# EAGLE design v3_LED_cpu (EAGLE 4.16)
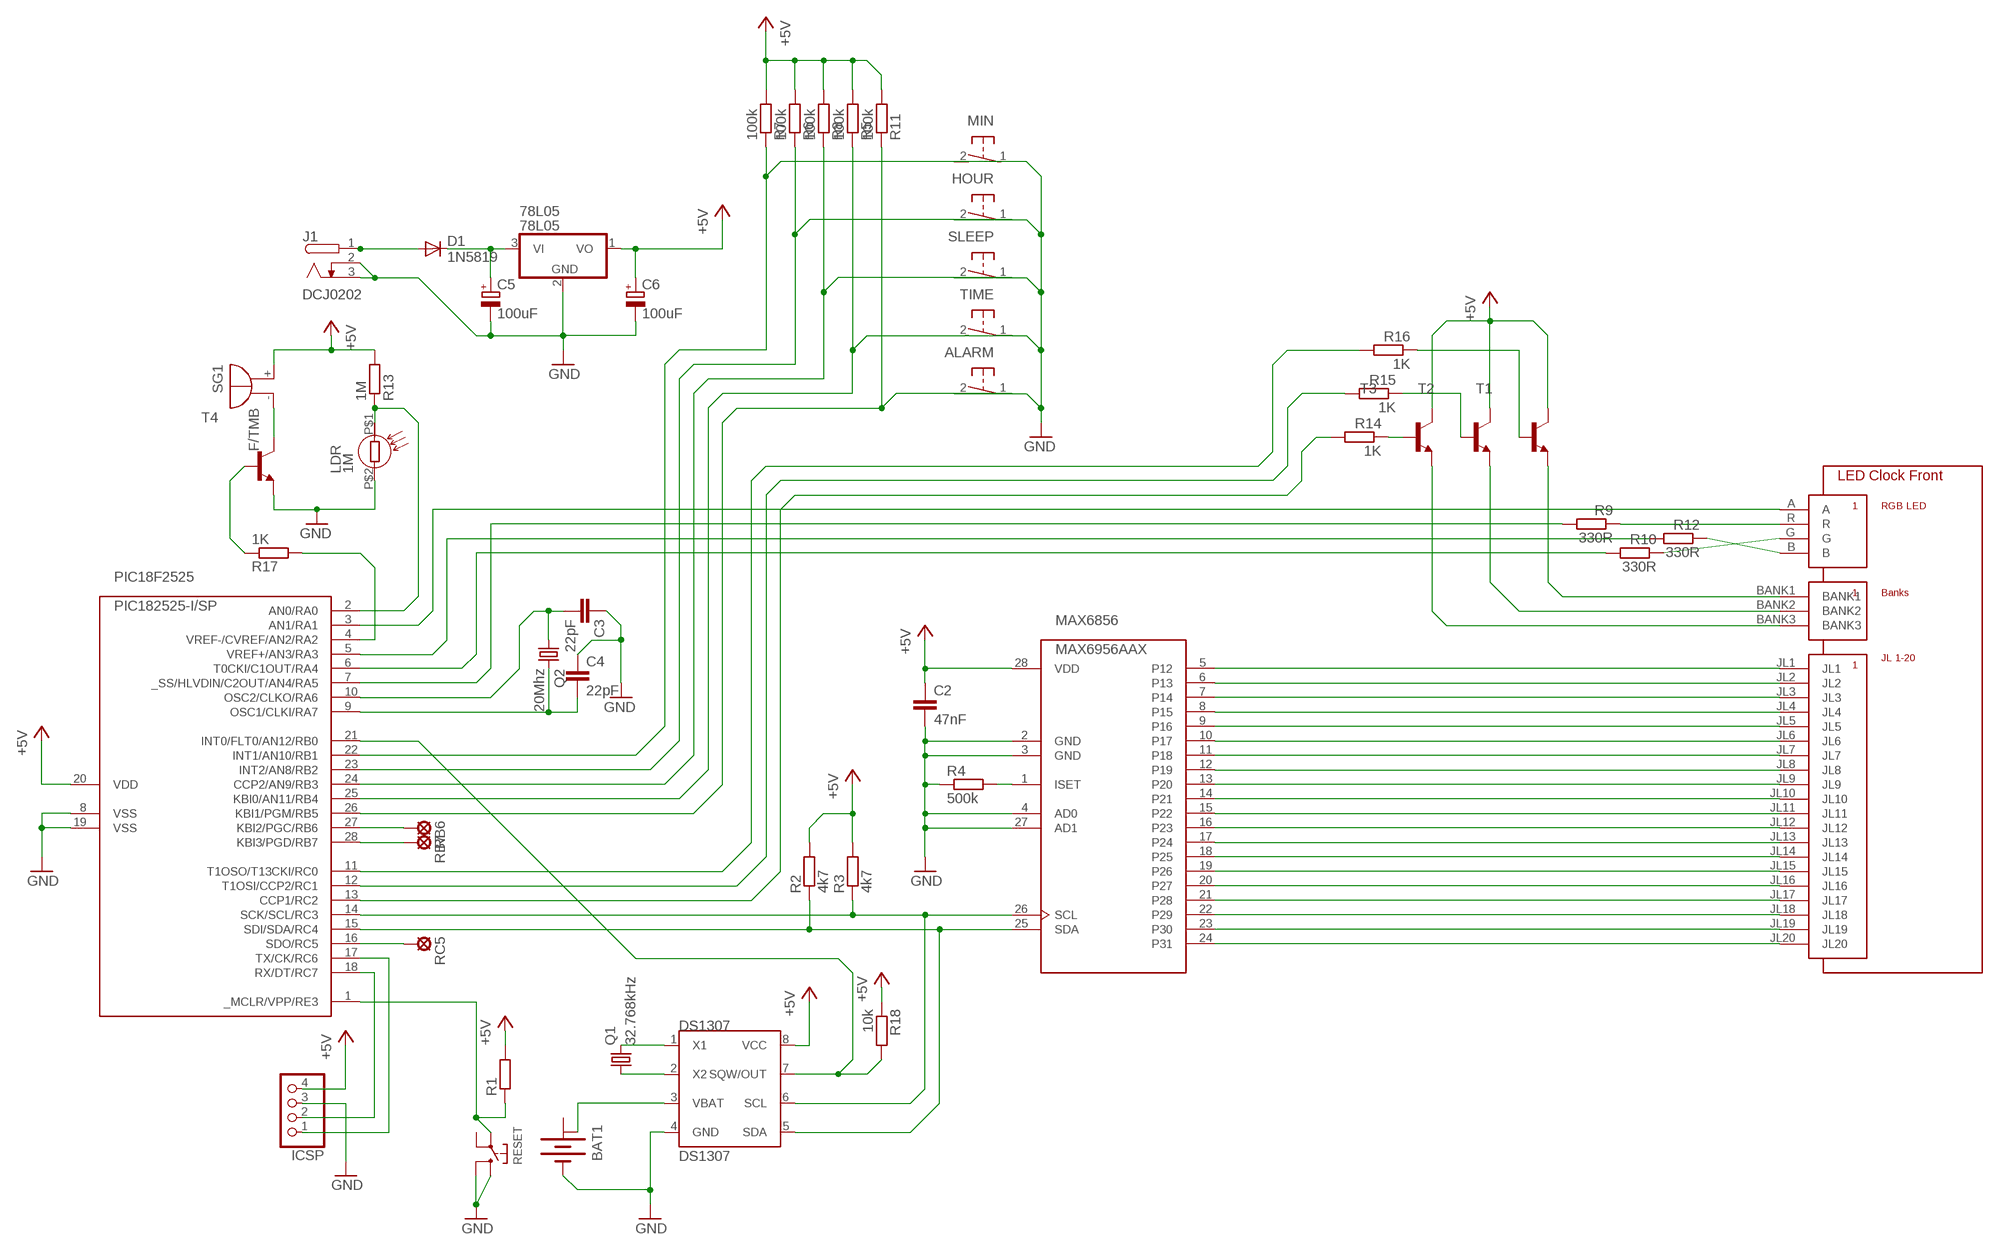
[diagram p0: schematic, sheet 1]

## Parts
78L05  78L05  [TO92-INLINE]
ALARM  ITT-PTS645_SIDEWAYS  [ITT-MINI_SIDEWAYS]
BAT1  BATTERY  [BATTERY]
C2  47nF  C-EUC0603  [C0603]
C3  22pF  C-EUC0603  [C0603]
C4  22pF  C-EUC0603  [C0603]
C5  100uF  CPOL-EUE2.5-7  [E2,5-7]
C6  100uF  CPOL-EUE2.5-7  [E2,5-7]
D1  1N5819  DIODE-F126-10  [F126-10]
DS1307  DS1307  [DIL08]
HOUR  ITT-PTS645_SIDEWAYS  [ITT-MINI_SIDEWAYS]
ICSP  PINHD-1X4  [1X04]
J1  DCJ0202  [DCJ0202]
LDR  1M  LDRSIDE  [LDR_4MM_SIDE]
MAX6856  MAX6956AAX  [DIL28-3]
MIN  ITT-PTS645_SIDEWAYS  [ITT-MINI_SIDEWAYS]
PIC18F2525  PIC182525-I/SP  [DIL28-3]
Q1  32.768kHz  CRYTALTC26H  [TC26H]
Q2  20Mhz  CRYTALHC49U-V  [HC49U-V]
R1  R-EU_R0603  [R0603]
R2  4k7  R-EU_R0603  [R0603]
R3  4k7  R-EU_R0603  [R0603]
R4  500k  R-EU_R0603  [R0603]
R5  100k  R-EU_R0603  [R0603]
R6  100k  R-EU_R0603  [R0603]
R7  100k  R-EU_R0603  [R0603]
R8  100k  R-EU_R0603  [R0603]
R9  330R  R-EU_R0603  [R0603]
R10  330R  R-EU_R0603  [R0603]
R11  100k  R-EU_R0603  [R0603]
R12  330R  R-EU_R0603  [R0603]
R13  1M  R-EU_R0603  [R0603]
R14  1K  R-EU_R0603  [R0603]
R15  1K  R-EU_R0603  [R0603]
R16  1K  R-EU_R0603  [R0603]
R17  1K  R-EU_R0603  [R0603]
R18  10k  R-EU_R0603  [R0603]
RB6  LSP10  [LSP10]
RB7  LSP10  [LSP10]
RC5  LSP10  [LSP10]
RESET  ITT-PTS645  [ITT-MINI]
SG1  F/TMB  [F/TMB]
SLEEP  ITT-PTS645_SIDEWAYS  [ITT-MINI_SIDEWAYS]
T1  BC547B-NPN-TO92-EBC  [TO92-EBC]
T2  BC547B-NPN-TO92-EBC  [TO92-EBC]
T3  BC547B-NPN-TO92-EBC  [TO92-EBC]
T4  BC547B-NPN-TO92-EBC  [TO92-EBC]
TIME  ITT-PTS645_SIDEWAYS  [ITT-MINI_SIDEWAYS]
U$1  LEDCLOCK_FRONT  [LEDCLOCK_FRONT]

## Nets
+5V: 78L05.1(VO) C2.1 C6.+ DS1307.8(VCC) ICSP.4 MAX6856.28(VDD) PIC18F2525.20(VDD) R1.2 R2.2 R3.2 R5.2 R6.2 R7.2 R8.2 R11.2 R13.2 R18.1 SG1.+ T1.C T2.C T3.C
GND: 78L05.2(GND) ALARM.2(S) BAT1.- C2.2 C3.1 C4.1 C5.- C6.- DS1307.4(GND) HOUR.2(S) ICSP.3 J1.2 J1.3 LDR.P$2 MAX6856.2(GND) MAX6856.3(GND) MAX6856.4(AD0) MAX6856.27(AD1) MIN.2(S) PIC18F2525.8(VSS) PIC18F2525.19(VSS) R4.1 RESET.P$1(S1) RESET.P$2(S) SLEEP.2(S) T4.E TIME.2(S)
LED6: MAX6856.10(P17) U$1.JL6
N$1: DS1307.6(SCL) MAX6856.26(SCL) PIC18F2525.14(SCK/SCL/RC3) R3.1
N$2: DS1307.5(SDA) MAX6856.25(SDA) PIC18F2525.15(SDI/SDA/RC4) R2.1
N$3: MAX6856.15(P22) U$1.JL11
N$5: PIC18F2525.27(KBI2/PGC/RB6) RB6.MP
N$6: PIC18F2525.28(KBI3/PGD/RB7) RB7.MP
N$7: MAX6856.1(ISET) R4.2
N$8: PIC18F2525.1(_MCLR/VPP/RE3) R1.1 RESET.P$4(P)
N$9: PIC18F2525.16(SDO/RC5) RC5.MP
N$10: MAX6856.5(P12) U$1.JL1
N$11: MAX6856.6(P13) U$1.JL2
N$12: MAX6856.7(P14) U$1.JL3
N$13: MAX6856.8(P15) U$1.JL4
N$14: MAX6856.9(P16) U$1.JL5
N$15: MAX6856.16(P23) U$1.JL12
N$16: MAX6856.11(P18) U$1.JL7
N$17: MAX6856.17(P24) U$1.JL13
N$18: MAX6856.13(P20) U$1.JL9
N$19: MAX6856.14(P21) U$1.JL10
N$20: BAT1.+@1(+) DS1307.3(VBAT)
N$21: PIC18F2525.11(T1OSO/T13CKI/RC0) R16.2
N$22: MAX6856.12(P19) U$1.JL8
N$23: PIC18F2525.13(CCP1/RC2) R14.2
N$24: PIC18F2525.12(T1OSI/CCP2/RC1) R15.2
N$25: DS1307.1(X1) Q1.2
N$26: DS1307.2(X2) Q1.1
N$27: DS1307.7(SQW/OUT) PIC18F2525.21(INT0/FLT0/AN12/RB0) R18.2
N$28: PIC18F2525.5(VREF+/AN3/RA3) R12.2
N$29: R9.1 U$1.R
N$30: MAX6856.18(P25) U$1.JL14
N$31: R14.1 T3.B
N$32: ALARM.1(P) PIC18F2525.26(KBI1/PGM/RB5) R11.1
N$33: C4.2 PIC18F2525.9(OSC1/CLKI/RA7) Q2.2
N$34: C3.2 PIC18F2525.10(OSC2/CLKO/RA6) Q2.1
N$35: PIC18F2525.7(_SS/HLVDIN/C2OUT/AN4/RA5) R9.2
N$36: PIC18F2525.6(T0CKI/C1OUT/RA4) R10.2
N$37: MAX6856.19(P26) U$1.JL15
N$38: MAX6856.20(P27) U$1.JL16
N$39: MAX6856.21(P28) U$1.JL17
N$40: MAX6856.22(P29) U$1.JL18
N$41: MAX6856.23(P30) U$1.JL19
N$42: MAX6856.24(P31) U$1.JL20
N$43: T3.E U$1.BANK3
N$44: T2.E U$1.BANK2
N$45: T1.E U$1.BANK1
N$46: R10.1 U$1.G
N$47: R12.1 U$1.B
N$48: ICSP.2 PIC18F2525.18(RX/DT/RC7)
N$49: ICSP.1 PIC18F2525.17(TX/CK/RC6)
N$50: LDR.P$1 PIC18F2525.2(AN0/RA0) R13.1
N$51: R15.1 T2.B
N$52: 78L05.3(VI) C5.+ D1.C
N$53: D1.A J1.1
N$54: R16.1 T1.B
N$55: SG1.- T4.C
N$57: PIC18F2525.25(KBI0/AN11/RB4) R5.1 TIME.1(P)
N$58: R17.1 T4.B
N$59: PIC18F2525.4(VREF-/CVREF/AN2/RA2) R17.2
N$60: PIC18F2525.3(AN1/RA1) U$1.A
N$61: PIC18F2525.24(CCP2/AN9/RB3) R8.1 SLEEP.1(P)
N$62: HOUR.1(P) PIC18F2525.23(INT2/AN8/RB2) R6.1
N$63: MIN.1(P) PIC18F2525.22(INT1/AN10/RB1) R7.1
Unconnected: RESET.P$3(P1)

## Power pins joined to a net without a drawn wire
+: BAT1.+

## Library data of the parts
78L05 = linear:78*: Positive VOLTAGE REGULATOR Source: http://cache.national.com/ds/LM/LM78L05.pdf http://www.fairchildsemi.com/ds/LM/LM7805.pdf
ALARM HOUR MIN SLEEP TIME = catmacey:ITT-PTS645_SIDEWAYS: OMRON SWITCH
BAT1 = special:BATTERY: BATTERY
C2-C4 = rcl:C-EU: CAPACITOR, European symbol
C5 C6 = rcl:CPOL-EU: POLARIZED CAPACITOR, European symbol
D1 = diode:DIODE-: DIODE
DS1307 = dallas:DS1307*: I2C Serial RTC w/56 bytes battery backed RAM
ICSP = pinhead:PINHD-1X4: PIN HEADER
J1 = con-jack:DCJ0202: DC POWER JACK Source: DCJ0202.pdf
LDR = catmacey:LDR
MAX6856 = catmacey:MAX6956: The MAX6956 compact, serial-interfaced LED display driver/I/O expander provide microprocessors with up to 28 ports. Each port is individually user configurable to either a logic input, logic output, or common-anode (CA) LED constant-current segment driver. Each port configured as an LED segment driver behaves as a digitally controlled constant-current sink, with 16 equal current steps from 1.5mA to 24mA. The LED drivers are suitable for both discrete LEDs and CA numeric and alphanumeric LED digits. Each port configured as a general-purpose I/O (GPIO) can be either a push-pull logic output capable of sinking 10mA and sourcing 4.5mA, or a Schmitt logic input with optional internal pullup. Seven ports feature configurable transition detection logic, which generates an interrupt upon change of port logic level. The MAX6956 is controlled through an I2C-compatible 2-wire serial interface, and uses four-level logic to allow 16 I2C addresses from only 2 select pins. 400kbps I2C-Compatible Serial Interface 2.5V to 5.5V Operation -40°C to +125°C Temperature Range 20 or 28 I/O Ports, Each Configurable as Constant-Current LED Driver Push-Pull Logic Output Schmitt Logic Input Schmitt Logic Input with Internal Pullup 11μA (max) Shutdown Current 16-Step Individually Programmable Current Control for Each LED Logic Transition Detection for Seven I/O Ports
PIC18F2525 = catmacey:PIC18*2525: PIC18*2525 Microchip FLASH Microcontroller DEVICE FEATURES Feature PIC18*2525 Program Memory (bytes) 48k Program Memory (instructions) 24576 I/O Ports Ports A, B, C, (E) Capture/Compare/PWM Modules 2 Enhanced Capture/Compare/PWM Modules 0 Parallel Communications (PSP) No 10-bit Analog-to-Digital Module 10 input Channels Package Types 28-pin PDIP 28-pin SOIC NOTES: F only after 18, means standard voltage range from 4.2v to 5.5v LF after 18, means extended voltage range from 2.0v to 5.5v T after entire device number, means supplied in tape and reel TQFP packages only -E before / denotes extended temperature range from -40°C to +120°C -I before / denotes industrial temperature range from -40°C to +85°C /PT suffix denotes TQFP package /SO suffix denotes SOIC package /SP suffix denotes Skinny Plastic DIP package /P suffix denotes Plastic DIP package /ML suffix denotes QFN package
Q1 Q2 = crystal:CRYTAL: CRYSTAL
R1-R18 = rcl:R-EU_: RESISTOR, European symbol
RB6 RB7 RC5 = solpad:LSP10: SOLDER PAD drill 1.0 mm, distributor Buerklin, 12H555
RESET = catmacey:ITT-PTS645: ITT SWITCH
SG1 = buzzer:F/TMB: BUZZER Source: Buerklin
T1-T4 = transistor:*-NPN-: NPN Transistror
U$1 = catmacey:LEDCLOCK_FRONT

## Board
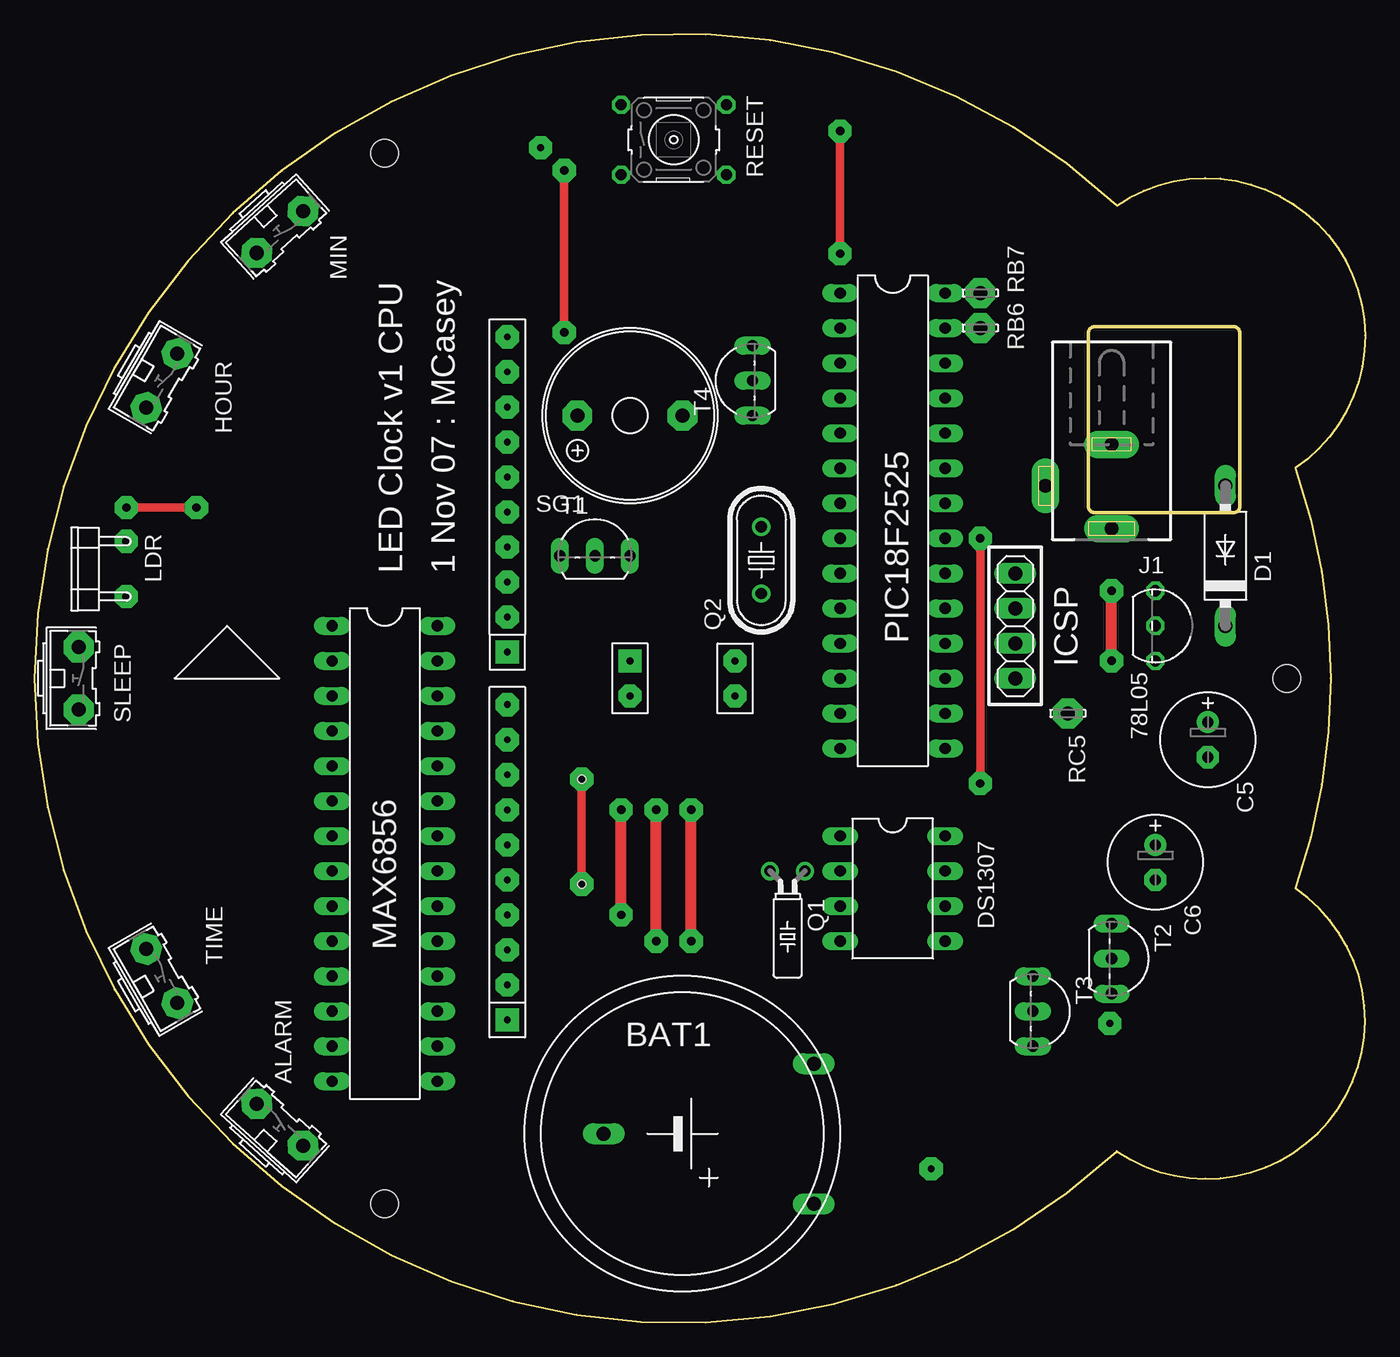
[diagram p1: board, top side]
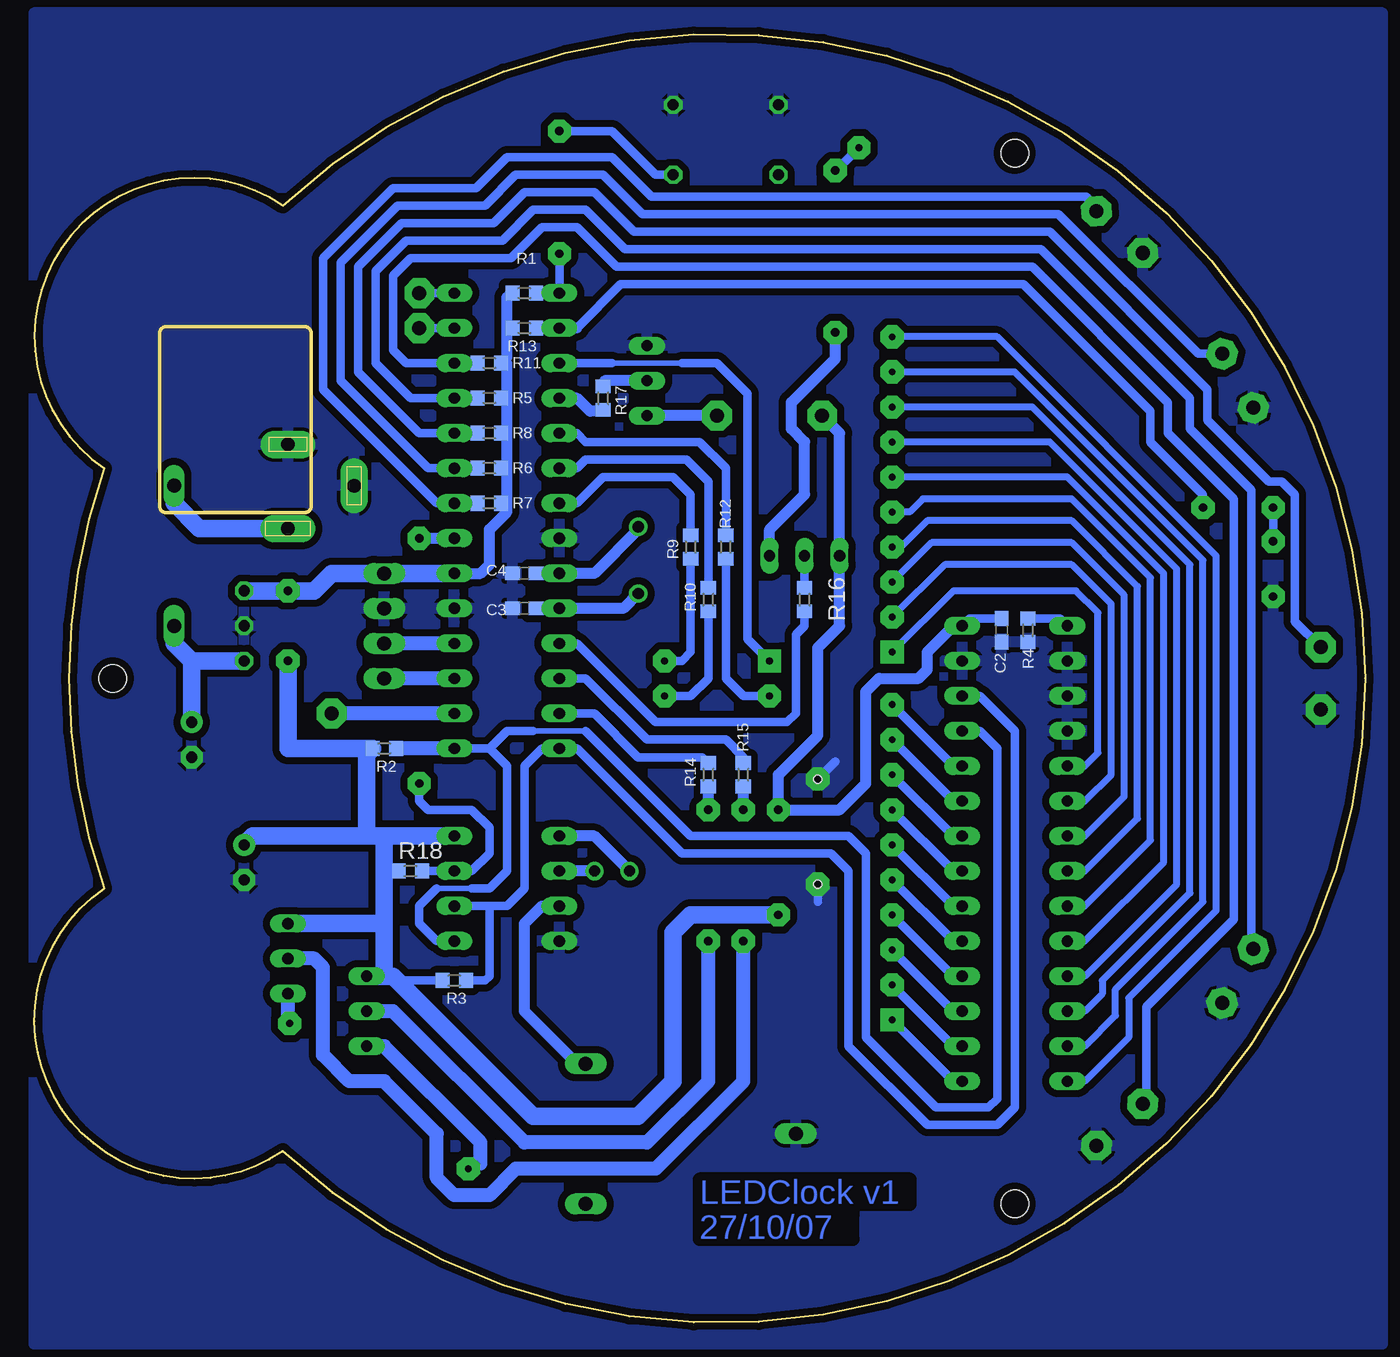
[diagram p2: board, bottom side, seen from below]

Size 96.48 x 93.38 mm. Coordinates in mm from the lower left corner, seen from the top.
Outline: 78.48,80.98 arc266 78.48,12.4 arc180 91.44,31.45 arc38 91.44,61.93 arc180 78.48,80.98
Copper layers (1*16): Top 0.035mm / dielectric 1.5mm / Bottom 0.035mm
Design rules "MAtts default": minimum track width 10mil, minimum drill 0.5mm, track to track 8mil, track to pad 8mil, pad to pad 8mil, via to via 8mil, smd to smd 8mil, copper to edge 8mil, drill to drill 8mil, minimum pad ring 10mil, minimum via ring 8mil, stop-mask expansion 4mil, vias tented up to drill 0mil, thermal gap 10mil
Holes 0.6 mm at 39.68,39.39 39.68,31.77

### Footprints (pad centres in the part's own frame; a part is rotated, then mirrored left to right if it is on the bottom)
TO92-INLINE = drill 0.813 octagon: 1 -2.54,0; 2 0,0; 3 2.54,0
ITT-MINI_SIDEWAYS = drill 1.016 pad 2.184 octagon: 1 -2.261,0.025; 2 2.261,0.025
BATTERY = drill 1.016 long: + 9.525,-5.08; +@1 9.525,5.08; - -5.715,0
C0603 = smd 1.1 x 1: 1 -0.85,0; 2 0.85,0
E2,5-7 = drill 0.813 pad 1.6 round: + -1.27,0 | drill 0.813 pad 1.6 octagon: - 1.27,0
F126-10 = drill 1.016 long: A 5.08,0; C -5.08,0
DIL08 = drill 0.813 long: 1 -3.81,-3.81; 2 -1.27,-3.81; 3 1.27,-3.81; 4 3.81,-3.81; 5 3.81,3.81; 6 1.27,3.81; 7 -1.27,3.81; 8 -3.81,3.81
1X04 = drill 1.016 long: 1 -3.81,0; 2 -1.27,0; 3 1.27,0; 4 3.81,0
DCJ0202 = drill 1 pad 2 long: 1 0,3.1; 2 4.8,0; 3 0,-3
LDR_4MM_SIDE = drill 0.6 pad 1.676 octagon: P$1 -2,0; P$2 2,0
DIL28-3 = drill 0.813 long: 1 -16.51,-3.81; 2 -13.97,-3.81; 3 -11.43,-3.81; 4 -8.89,-3.81; 5 -6.35,-3.81; 6 -3.81,-3.81; 7 -1.27,-3.81; 8 1.27,-3.81; 9 3.81,-3.81; 10 6.35,-3.81; 11 8.89,-3.81; 12 11.43,-3.81; 13 13.97,-3.81; 14 16.51,-3.81; 15 16.51,3.81; 16 13.97,3.81; 17 11.43,3.81; 18 8.89,3.81; 19 6.35,3.81; 20 3.81,3.81; 21 1.27,3.81; 22 -1.27,3.81; 23 -3.81,3.81; 24 -6.35,3.81; 25 -8.89,3.81; 26 -11.43,3.81; 27 -13.97,3.81; 28 -16.51,3.81
TC26H = drill 0.813 round: 1 -1.27,0; 2 1.27,0
HC49U-V = drill 0.813 round: 1 -2.413,0; 2 2.413,0
R0603 = smd 1 x 1.1: 1 -0.85,0; 2 0.85,0
LSP10 = drill 1.016 pad 2.159 octagon: MP 0,0
ITT-MINI = drill 0.8 octagon: P$1 -3.81,2.54; P$2 3.81,2.54; P$3 -3.81,-2.54; P$4 3.81,-2.54
F/TMB = drill 1.016 pad 2.159 octagon: + 3.81,0; - -3.81,0
TO92-EBC = drill 0.813 long: B 0,-1.27; C -2.54,-1.27; E 2.54,-1.27
LEDCLOCK_FRONT = drill 0.5 pad 1.676 square: A 1.27,3.81; JL1 1.905,12.7; JL11 -24.765,12.7 | drill 0.5 pad 1.676 octagon: B -1.27,3.81; BANK1 38.481,10.287; BANK2 -25.019,-30.988; BANK3 -35.56,-18.034; G -1.27,-3.81; JL2 4.445,12.7; JL3 6.985,12.7; JL4 9.525,12.7; JL5 12.065,12.7; JL6 14.605,12.7; JL7 17.145,12.7; JL8 19.685,12.7; JL9 22.225,12.7; JL10 24.765,12.7; JL12 -22.225,12.7; JL13 -19.685,12.7; JL14 -17.145,12.7; JL15 -14.605,12.7; JL16 -12.065,12.7; JL17 -9.525,12.7; JL18 -6.985,12.7; JL19 -4.445,12.7; JL20 -1.905,12.7; R 1.27,-3.81 | hole 2: -38.1,21.59; 38.1,21.59; 0,-43.815

### Placement (x,y rotation side)
78L05  81.28,50.5 270 top
ALARM  17.78,14.31 318 top
BAT1  46.99,13.67 0 top
C2  26.35,50.18 270 bottom
C3  60.96,51.77 0 bottom
C4  60.96,54.31 0 bottom
C5  85.09,42.25 270 top
C6  81.28,33.36 270 top
D1  86.36,55.58 90 top
DS1307  62.23,31.45 270 top
HOUR  9.2,68.28 240 top
ICSP  71.12,50.5 90 top
J1  78.1,60.66 180 top
LDR  6.66,54.63 270 top
MAX6856  25.4,33.99 270 top
MIN  17.78,79.08 222 top
PIC18F2525  62.23,58.12 270 top
Q1  54.61,32.72 180 top
Q2  52.7,55.26 90 top
R1  60.96,74.63 180 bottom
R2  71.12,41.61 180 bottom
R3  66.04,24.78 180 bottom
R4  24.44,50.18 90 bottom
R5  63.5,67.01 0 bottom
R6  63.5,61.93 0 bottom
R7  63.5,59.39 0 bottom
R8  63.5,64.47 0 bottom
R9  48.89,56.22 90 bottom
R10  47.62,52.41 90 bottom
R11  63.5,69.55 0 bottom
R12  46.35,56.22 90 bottom
R13  60.96,72.09 180 bottom
R14  47.62,39.71 90 bottom
R15  45.08,39.71 90 bottom
R16  40.64,52.41 270 bottom
R17  55.24,67.01 270 bottom
R18  69.21,32.72 0 bottom
RB6  68.58,72.09 0 top
RB7  68.58,74.63 0 top
RC5  74.93,44.15 0 top
RESET  46.35,85.74 0 top
SG1  43.18,65.74 180 top
SLEEP  3.17,46.69 270 top
T1  40.64,56.85 0 top
T2  79.37,26.37 270 top
T3  73.66,22.56 270 top
T4  50.8,68.28 90 top
TIME  9.2,25.1 300 top
U$1  46.99,46.69 90 top
U$2  [SOCKET]  81.91,63.2 180 top

### Tracks (layer width: path | path; a pad name or v marks a point on that pad's centre or on a via)
+5V  (via drill 0.6 pad 1.68)
  Top 0.813: v78.1,47.96 v78.1,53.04 | v42.54,29.55 v42.54,37.17
  Bottom 0.61: 62.23,67.01 R5.2 | 62.23,64.47 R8.2 | 62.23,61.93 R6.2 | 62.23,69.97 62.23,69.55 R11.2 | C2.1 28.67,51.03 MAX6856.28 | R3.2 70.8,24.78 71.12,25.1 | 71.12,32.72 R18.1
  Bottom 0.813: 62.23,69.55 62.23,67.01 62.23,64.47 62.23,61.93 62.23,59.39 | PIC18F2525.20 64.13,54.31 63.5,54.95 63.5,57.49 62.23,58.76 62.23,59.39 | 62.23,59.39 R7.2 | SG1.+ 38.1,64.47 T1.C 38.1,50.5 39.68,48.91 39.68,42.56 42.54,39.71 v42.54,37.17 38.1,37.17 36.19,39.07 36.19,45.74 35.24,46.69 32.38,46.69 31.75,47.33 31.75,48.6 29.84,50.5 MAX6856.28 | 62.23,69.97 62.23,72.09 | 62.23,72.09 R13.2 | R1.2 61.91,74.63 62.23,74.31 62.23,72.09
  Bottom 1.27: PIC18F2525.20 ICSP.4 74.93,54.31 76.2,53.04 v78.1,53.04 78L05.1 | 71.12,25.1 71.12,28.91 | 71.12,28.91 T2.C | 71.12,28.91 71.12,32.72 71.12,35.26 | 71.12,35.26 72.39,35.26 | 71.12,35.26 DS1307.8 | v78.1,47.96 78.1,41.61 R2.2 72.39,41.19 72.39,35.26 | v42.54,29.55 48.89,29.55 50.16,28.28 50.16,17.48 52.7,14.94 60.32,14.94 70.48,25.1 71.12,25.1 | 71.12,25.1 T3.C | C6.+ 80.64,35.26 72.39,35.26
GND  (via drill 0.6 pad 1.68)
  Top 0.61: v39.68,31.77 v39.68,39.39
  Bottom 0.61: v39.68,39.39 38.41,40.66 | v39.68,31.77 39.68,30.5
  pour Bottom (isolate 0.508): -1.27,94.95 96.52,94.95 96.52,-1.57 -1.27,-1.57
LED6
  Bottom 0.508: MAX6856.10 20.32,27.64 14.6,33.36 14.6,54.31 21.59,61.3 U$1.JL6
N$1
  Bottom 0.61: 63.5,30.18 62.23,30.18 60.96,31.45 60.96,40.34 59.69,41.61 PIC18F2525.14 57.15,41.61 49.53,33.99 38.73,33.99 37.46,32.72 37.46,20.02 31.75,14.31 26.67,14.31 25.4,15.58 25.4,42.88 27.94,45.42 MAX6856.26 | 63.5,30.18 DS1307.6 | 63.5,30.18 63.5,25.1 63.81,24.78 R3.1
N$2
  Bottom 0.406: 67.31,27.64 DS1307.5 | 64.77,31.45 67.31,31.45 | 56.51,42.88 60.32,42.88
  Bottom 0.61: MAX6856.25 27.94,42.88 26.67,41.61 26.67,16.21 27.3,15.58 31.11,15.58 36.19,20.66 36.19,33.99 37.46,35.26 48.89,35.26 56.51,42.88 | 67.31,27.64 68.58,28.91 68.58,30.18 67.31,31.45 | 64.77,31.45 63.5,31.45 62.23,32.72 62.23,40.34 63.5,41.61 | 63.5,41.61 PIC18F2525.15 | 63.5,41.61 62.23,42.88 60.32,42.88
  Bottom 1.016: PIC18F2525.15 R2.1
N$3
  Bottom 0.61: MAX6856.15 29.84,17.48 U$1.JL11
N$5
  Bottom 0.61: PIC18F2525.27 RB6.MP
N$6
  Bottom 0.61: PIC18F2525.28 RB7.MP
N$7
  Bottom 0.61: R4.2 22.12,51.03 MAX6856.1
N$8  (via drill 0.6 pad 1.68)
  Top 0.61: v58.42,86.38 v58.42,77.49
  Bottom 0.61: v58.42,77.49 PIC18F2525.1 | RESET.P$4 51.43,83.2 54.61,86.38 v58.42,86.38
  Bottom 0.813: PIC18F2525.1 R1.1
N$9
  Bottom 1.016: PIC18F2525.16 RC5.MP
N$10
  Bottom 0.508: MAX6856.5 20.32,40.34 19.36,41.29 19.36,51.45 20.95,53.04 29.84,53.04 U$1.JL1
N$11
  Bottom 0.508: MAX6856.6 20.32,37.8 18.41,39.71 18.41,52.09 21.27,54.95 30.48,54.95 U$1.JL2
N$12
  Bottom 0.508: MAX6856.7 20.32,35.26 17.46,38.12 17.46,52.72 21.27,56.53 31.43,56.53 U$1.JL3
N$13
  Bottom 0.508: MAX6856.8 20.32,32.72 16.51,36.53 16.51,53.36 21.27,58.12 31.75,58.12 33.65,56.22 U$1.JL4
N$14
  Bottom 0.508: MAX6856.9 20.32,30.18 15.55,34.94 15.55,53.99 21.27,59.71 32.06,59.71 33.02,58.76 U$1.JL5
N$15
  Bottom 0.61: MAX6856.16 29.84,20.02 U$1.JL12
N$16
  Bottom 0.508: MAX6856.11 20.32,25.1 13.65,31.77 13.65,54.63 22.86,63.84 U$1.JL7
N$17
  Bottom 0.61: MAX6856.17 29.84,22.56 U$1.JL13
N$18
  Bottom 0.508: MAX6856.13 20.32,20.02 18.09,22.24 18.09,24.15 11.74,30.5 11.74,55.26 25.4,68.92 U$1.JL9
N$19
  Bottom 0.508: MAX6856.14 20.32,17.48 17.14,20.66 17.14,23.51 10.79,29.86 10.79,55.58 26.67,71.46 U$1.JL10
N$20
  Bottom 0.813: DS1307.3 59.69,30.18 60.96,28.91 60.96,22.56 57.15,18.75 BAT1.+@1
N$21
  Bottom 0.61: PIC18F2525.11 57.15,49.23 51.43,43.52 41.91,43.52 41.27,44.15 41.27,49.87 40.64,50.5 R16.2
N$22
  Bottom 0.508: MAX6856.12 20.32,22.56 19.05,23.83 19.05,24.78 12.7,31.13 12.7,54.95 24.13,66.38 U$1.JL8
N$23
  Bottom 0.61: PIC18F2525.13 55.88,44.15 52.7,40.98 48.04,40.98 R14.2
N$24
  Bottom 0.61: PIC18F2525.12 56.51,46.69 52.07,42.25 46.35,42.25 45.08,40.98 R15.2
N$25
  Bottom 0.813: Q1.2 55.88,35.26 DS1307.1
N$26
  Bottom 0.813: Q1.1 DS1307.2
N$27  (via drill 0.6 pad 1.68)
  Top 0.61: v68.58,39.07 v68.58,56.85
  Bottom 0.61: v68.58,39.07 68.58,37.8 67.94,37.17 64.77,37.17 63.5,35.9 63.5,33.99 64.77,32.72 DS1307.7 R18.2
  Bottom 0.813: v68.58,56.85 PIC18F2525.21
N$28
  Bottom 0.61: R12.2 46.35,61.93 48.26,63.84 56.51,63.84 57.15,64.47 PIC18F2525.5
N$29
  Bottom 0.61: R9.1 48.89,48.6 49.53,47.96 U$1.R
N$30
  Bottom 0.61: MAX6856.18 29.84,25.1 U$1.JL14
N$31  (via drill 0.6 pad 1.68)
  Top 0.813: v47.62,27.64 v47.62,37.17
  Bottom 0.813: v47.62,37.17 R14.1
  Bottom 1.016: v47.62,27.64 47.62,17.48 52.07,13.04 60.96,13.04 70.48,22.56 T3.B
N$32
  Bottom 0.61: ALARM.1 16.11,15.65 15.87,15.89 15.87,22.88 9.52,29.23 9.52,59.71 14.28,64.47 14.28,66.69 24.13,76.54 54.29,76.54 57.15,79.39 59.69,79.39 61.91,77.17 69.21,77.17 70.48,75.9 70.48,70.5 69.53,69.55 PIC18F2525.26 R11.1
N$33
  Bottom 0.813: C4.2 PIC18F2525.9 55.88,54.31 52.7,57.49 Q2.2
N$34
  Bottom 0.61: PIC18F2525.10 C3.2
  Bottom 0.813: Q2.1 53.78,51.77 PIC18F2525.10
N$35
  Bottom 0.61: R9.2 48.89,60.03 50.16,61.3 55.24,61.3 57.15,59.39 PIC18F2525.7
N$36
  Bottom 0.61: R10.2 47.62,60.98 49.21,62.57 56.51,62.57 57.15,61.93 PIC18F2525.6
N$37
  Bottom 0.61: MAX6856.19 29.84,27.64 U$1.JL15
N$38
  Bottom 0.61: U$1.JL16 29.84,30.18 MAX6856.20
N$39
  Bottom 0.61: U$1.JL17 29.84,32.72 MAX6856.21
N$40
  Bottom 0.61: U$1.JL18 29.84,35.26 MAX6856.22
N$41
  Bottom 0.61: U$1.JL19 29.84,37.8 MAX6856.23
N$42
  Bottom 0.61: U$1.JL20 29.84,40.34 MAX6856.24
N$43
  Bottom 0.813: 64.13,11.51 U$1.BANK3
  Bottom 1.016: T3.E 71.12,20.02 64.13,13.04 64.13,11.51
N$44
  Bottom 0.813: U$1.BANK2 77.97,21.8 78.1,21.93
  Bottom 1.016: 78.1,21.93 T2.E
N$45  (via drill 0.6 pad 1.68)
  Top 0.61: v38.41,71.77 v38.41,83.52
  Bottom 0.61: U$1.BANK1 37.08,84.79 v38.41,83.52
  Bottom 0.813: T1.E 43.18,57.49 40.64,60.03 40.64,63.84 41.59,64.79 41.59,66.69 38.41,69.87 v38.41,71.77
N$46
  Bottom 0.61: U$1.G 48.89,45.42 47.62,46.69 R10.1
N$47
  Bottom 0.61: U$1.B 45.08,45.42 46.35,46.69 R12.1
N$48
  Bottom 1.016: PIC18F2525.18 ICSP.2
N$49
  Bottom 1.016: PIC18F2525.17 ICSP.1
N$50  (via drill 0.6 pad 1.68)
  Top 0.61: v6.66,59.07 v11.74,59.07
  Bottom 0.61: 57.15,72.09 53.97,75.27 24.76,75.27 15.55,66.06 15.55,63.84 11.74,60.03 v11.74,59.07 | PIC18F2525.2 R13.1 | LDR.P$1 v6.66,59.07
  Bottom 0.813: 57.15,72.09 PIC18F2525.2
N$51  (via drill 0.6 pad 1.68)
  Top 0.813: v45.08,27.64 v45.08,37.17
  Bottom 0.813: v45.08,37.17 R15.1
  Bottom 1.016: T2.B 76.2,26.37 75.56,25.74 75.56,19.39 73.66,17.48 71.12,17.48 67.31,13.67 67.31,10.5 66.04,9.23 63.5,9.23 61.59,11.13 51.43,11.13 45.08,17.48 v45.08,27.64
N$52
  Bottom 1.27: 85.09,47.96 86.36,49.23 D1.C | 78L05.3 85.09,47.96 | 85.09,47.96 C5.+
N$53
  Bottom 1.27: J1.1 84.53,57.56 86.36,59.39 D1.A
N$54
  Bottom 0.61: R16.1 T1.B
N$55
  Bottom 0.813: SG1.- T4.C
N$57
  Bottom 0.61: TIME.1 8.25,27.23 8.25,60.34 12.7,64.79 12.7,67.01 23.49,77.81 53.65,77.81 56.51,80.66 60.32,80.66 62.54,78.44 69.53,78.44 71.75,76.22 71.75,69.55 69.21,67.01 PIC18F2525.25 R5.1
N$58
  Bottom 0.813: R17.1 55.14,68.28 T4.B
N$59
  Bottom 0.813: R17.2 55.66,66.06 56.19,66.06 57.15,67.01 PIC18F2525.4
N$60
  Bottom 0.406: 49.53,69.55 54.61,69.55
  Bottom 0.61: 49.53,69.55 46.99,69.55 44.76,67.33 44.76,49.55 U$1.A | 54.61,69.55 PIC18F2525.3
N$61
  Bottom 0.61: SLEEP.1 5.08,50.83 5.08,60.03 6.03,60.98 6.98,60.98 11.43,65.42 11.43,67.65 22.86,79.08 53.02,79.08 55.88,81.93 60.96,81.93 63.18,79.71 69.85,79.71 73.02,76.54 73.02,68.92 68.58,64.47 PIC18F2525.24 R8.1
N$62
  Bottom 0.61: HOUR.1 12.1,70.23 22.22,80.35 52.38,80.35 55.24,83.2 61.59,83.2 63.81,80.98 70.16,80.98 74.29,76.85 74.29,68.28 67.94,61.93 PIC18F2525.23 R6.1
N$63
  Bottom 0.61: 24.13,81.62 23.55,81.62 | 24.13,81.62 51.75,81.62 54.61,84.47 62.23,84.47 64.45,82.25 70.48,82.25 75.56,77.17 75.56,67.65 67.31,59.39 PIC18F2525.22 R7.1 | MIN.1 20.2,81.62 24.13,81.62

### Text on the board
Bottom: LEDClock v1 | 27/10/07
tPlace: LED Clock v1 CPU | 1 Nov 07 : MCasey